# Altium schematic sheet PSU_USB_MCU.SchDoc
size A4
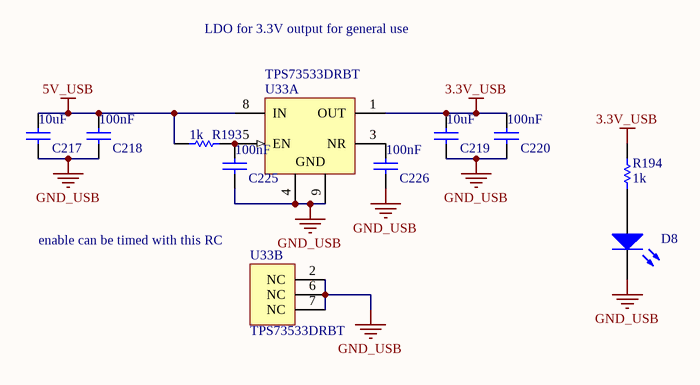
[diagram p0: PSU_USB_MCU.SchDoc]

## Parts
C217  value 10uF  [CAPC0805(2012)145_L]  (hidden comment: CAP0805)
C218  value 100nF  [CAPC0402(1005)60_L]  (hidden comment: CAP0402)
C219  value 10uF  [CAPC0805(2012)145_L]  (hidden comment: CAP0805)
C220  value 100nF  [CAPC0402(1005)60_L]  (hidden comment: CAP0402)
C225  value 100nF  [CAPC0402(1005)60_L]  (hidden comment: CAP0402)
C226  value 100nF  [CAPC0402(1005)60_L]  (hidden comment: CAP0402)
D8  Green_LED_150060GS75000  [Green_LED_150060GS75000]  (value not drawn)
R193  value 1k  [RESC0402(1005)_L]  (hidden comment: RES0402)
R194  value 1k  [RESC0402(1005)_L]  (hidden comment: RES0402)
U33  TPS73533DRBT  [DRB0008A_V]  (parts A,B of 2)

## Nets
3.3V_USB: C219.2 C220.1 R194.1 U33.1(OUT)
5V_USB: C217.2 C218.1 R193.2 U33.8(IN)
GND_USB: C217.1 C218.2 C219.1 C220.2 C225.2 C226.2 D8.1 U33.2(NC) U33.4(GND) U33.6(NC) U33.7(NC) U33.9(GND)
NetC225_1: C225.1 R193.1 U33.5(EN)
NetC226_1: C226.1 U33.3(NR)
NetD8_2: D8.2 R194.2

## Notes on the sheet
- LDO for 3.3V output for general use
- enable can be timed with this RC

## Library data of the parts
C217 C219 = CMP-1590-00003-1: 0805 (2012 Metric) Chip Capacitor; Case-EIA: 0805; Case-Metric: 2012; PackageReference: CAPC0805(2012)145
C218 C220 C225 C226 = CMP-1590-00004-1: 0402 (1005 Metric) Chip Capacitor; Case-EIA: 0402; Case-Metric: 1005; PackageReference: CAPC0402(1005)60
D8 = Green_LED_150060GS75000: WURTH ELEKTRONIK  150060GS75000  LED, Green, SMD, 30 mA, 3.2 V, 520 nm; Unit Cost: 0.287; ComponentLinkURL1: http://ie.farnell.com/wurth-elektronik/150060gs75000/led-0603-green-430mcd-520nm/dp/2322070?ost=150060GS75000&selectedCategoryId=&categoryNameResp=All%2BCategories&searchView=table&iscrfnonsku=false; Manufacturer Part Number: 150060GS75000; Supplier 1: Farnell; Supplier Part Number 1: 2322070; Manufacturer: WURTH ELEKTRONIK
R193 R194 = CMP-1591-00004-1: 0402 (1005 Metric) Chip Resistor; Case-EIA: 0402; Case-Metric: 1005; PackageReference: RESC0402(1005)
U33 = CMP-0395-00583-2: Single Output High PSRR LDO, 500 mA, Fixed 3.3 V Output, 2.7 to 6.5 V Input, with Low IQ, 8-pin SON (DRB), -40 to 125 degC, Green (RoHS & no Sb/Br); Manufacturer: Texas Instruments; SubFamily: Single Channel LDO; Vout Adj(Min)(V): 3.3; Iq(Typ)(mA): 0.04; Vdo(Typ)(mV): 280; Vin(Min)(V): 2.7; Vin(Max)(V): 6.5; Accuracy(%): 2; Iout(Max)(A): 0.5; ComponentLink3Description: Package Specification; ComponentLink2Description: Datasheet; DatasheetVersion: SBVS087J; ComponentLink1Description: Manufacturer URL; PartNumber: TPS73533DRBT; ComponentLink2URL: http://www.ti.com/general/docs/lit/getliterature.tsp?genericPartNumber=TPS73533&fileType=pdf; ComponentLink3URL: http://www.ti.com/litv/pdf/mpds118h; Fixed Output Options(V): 3.3; Eco-Plan: Green (RoHS & no Sb/Br); ComponentLink1URL: http://www.ti.com/; PackageDescription: 8-Pin Plastic Small Outline, Body 3 x 3 mm, Pitch 0.65 mm; Mounting Technology: Surface Mount; PackageVersion: 4203482-2/K; Vout Adj(Max)(V): 3.3; PackageReference: DRB0008A